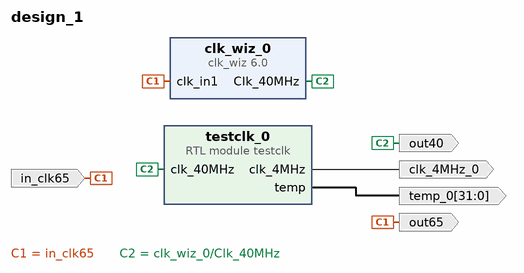
[diagram p0: block diagram of the top level]
# Vivado block design design_1, xc7z007sclg225-1, Vivado 2018.3
create_bd_design design_1

create_bd_port -dir O clk_4MHz_0
create_bd_port -dir O -from 31 -to 0 temp_0
create_bd_port -dir O -type clk out65
create_bd_port -dir O -type clk out40
create_bd_port -dir I in_clk65

create_bd_cell -type ip -vlnv xilinx.com:ip:clk_wiz:6.0 clk_wiz_0
set_property -dict [list \
  CONFIG.CLKIN1_JITTER_PS 153.84 \
  CONFIG.CLKOUT1_JITTER 183.203 \
  CONFIG.CLKOUT1_PHASE_ERROR 109.791 \
  CONFIG.CLKOUT1_REQUESTED_OUT_FREQ 40 \
  CONFIG.CLK_OUT1_PORT Clk_40MHz \
  CONFIG.MMCM_CLKFBOUT_MULT_F 15.000 \
  CONFIG.MMCM_CLKIN1_PERIOD 15.385 \
  CONFIG.MMCM_CLKIN2_PERIOD 10.0 \
  CONFIG.MMCM_CLKOUT0_DIVIDE_F 24.375 \
  CONFIG.MMCM_DIVCLK_DIVIDE 1 \
  CONFIG.PRIM_IN_FREQ 65 \
  CONFIG.USE_LOCKED false \
  CONFIG.USE_RESET false \
] [get_bd_cells clk_wiz_0]
create_bd_cell -type module -reference testclk testclk_0

# ---- connections ----

connect_bd_net -net vhdlnoclk_0_clk65MHz [get_bd_ports in_clk65] [get_bd_pins clk_wiz_0/clk_in1] [get_bd_ports out65]
connect_bd_net [get_bd_pins clk_wiz_0/Clk_40MHz] [get_bd_ports out40] [get_bd_pins testclk_0/clk_40MHz]
connect_bd_net [get_bd_pins testclk_0/clk_4MHz] [get_bd_ports clk_4MHz_0]
connect_bd_net [get_bd_pins testclk_0/temp] [get_bd_ports temp_0]

validate_bd_design
save_bd_design
